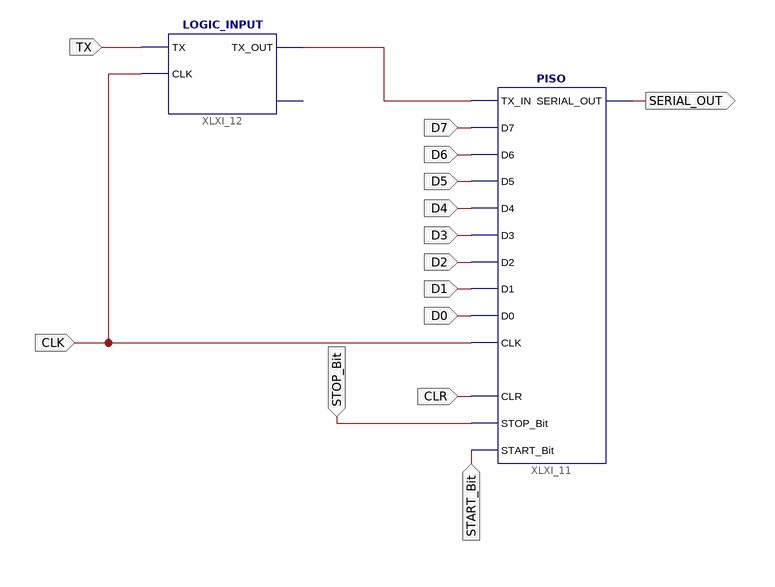
[diagram p0: schematic sheet 1]
// Xilinx ISE schematic tx.sch (spartan3e) as structural Verilog: 2 symbols, 14 ports
module tx (
  input  CLK,
  input  TX,
  input  D7,
  input  D6,
  input  D5,
  input  D4,
  input  D3,
  input  D2,
  input  D1,
  input  D0,
  input  START_Bit,
  input  STOP_Bit,
  input  CLR,
  output SERIAL_OUT
);

  wire TX_OUT;

  PISO XLXI_11 (
    .TX_IN(TX_OUT), .D7(D7), .D6(D6), .D5(D5), .D4(D4), .D3(D3), .D2(D2), .D1(D1), .D0(D0), .CLK(CLK),
    .STOP_Bit(STOP_Bit), .START_Bit(START_Bit), .CLR(CLR), .SERIAL_OUT(SERIAL_OUT));
  LOGIC_INPUT XLXI_12 (.CLK(CLK), .TX(TX), .TX_OUT(TX_OUT));  // open: RESET
endmodule
